# Altium schematic sheet RF-Remute-FT.SchDoc
size C; SheetNumber: 1; SheetTotal: 1
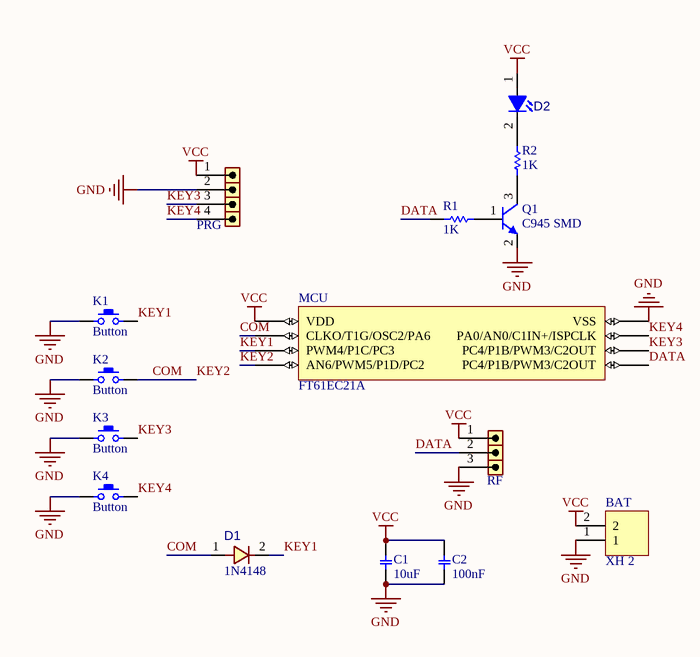
[diagram p0: RF-Remute-FT.SchDoc]

## Parts
BAT  XH 2  [XH 2 PIN ( White )]
C1  value 10uF  [C0805]  (hidden comment: Capacitor SMD 0805)
C2  value 100nF  [C0805]  (hidden comment: Capacitor SMD 0805)
D1  value 1N4148  [D_SOD80]  (hidden comment: 1N4148 SMD)
D2  LED SMD 0805  [LED SMD 0805 (Green)]  (value not drawn)
K1  Button  [BUTTON]
K2  Button  [BUTTON]
K3  Button  [BUTTON]
K4  Button  [BUTTON]
MCU  FT61EC21A  [SOP-8]
PRG  Female Header Single 4  [HDR_F_1X4]  (value not drawn)
Q1  value C945 SMD  [SOT-23]  (hidden comment: C945 NPN SMD)
R1  value 1K  [R0805]  (hidden comment: Resistor SMD 0805)
R2  value 1K  [R0805]  (hidden comment: Resistor SMD 0805)
RF  Female Header Single 3  [HDR_F_1X3]  (value not drawn)

## Nets
GND: BAT.1 C1.1 C2.1 K1.1 K2.1 K3.1 K4.1 MCU.8(VSS) PRG.2 Q1.2(E) RF.3
VCC: BAT.2 C1.2 C2.2 D2.1(ANODE) MCU.1(VDD) PRG.1 RF.1
COM: D1.1 K2.2 MCU.2(CLKO/T1G/OSC2/PA6) MCU.4(AN6/PWM5/P1D/PC2)  [also labelled KEY2]
DATA: MCU.5(PC4/P1B/PWM3/C2OUT) R1.2 RF.2
KEY1: D1.2 K1.2 MCU.3(PWM4/P1C/PC3)
KEY3: K3.2 MCU.6(PC4/P1B/PWM3/C2OUT) PRG.3
KEY4: K4.2 MCU.7(PA0/AN0/C1IN+/ISPCLK) PRG.4
NetD2_2: D2.2(CATHODE) R2.2
NetQ1_1: Q1.1(B) R1.1
NetQ1_3: Q1.3(C) R2.1

## Library data of the parts
BAT = Conector XH 2 Pin: ComponentLink1Description: Tarahiboard; ComponentLink1URL: https://www.tarahiboard.com/product/library-pack; DatasheetVersion: 2022
C1 C2 = Capacitor SMD 0805: Capacitor C SMD 0805; DatasheetVersion: 2022; ComponentLink1Description: Tarahiboard; ComponentLink1URL: https://www.tarahiboard.com
D1 = 1N4148 SMD: DIODE, FAST SWTICHING, 0.3A, 0.5W; DatasheetVersion: 2022; ComponentLink1Description: Tarahiboard; ComponentLink1URL: https://www.tarahiboard.com/product/library-pack
K1-K4 = BUTTON-6.3.4-SMD: Manufacturer: Panasonic; Manufacturer Part Number: EVQ-PE605T; Mechanical Life: 30000Cycles; Actuator Color: Brown; Voltage Rating (DC): 12V; Throw Configuration: SPST; Contact Resistance: 100mR; Operating Force: 2.4N; Current Rating: 50mA; Illumination Type: Non-Illuminated,Illuminated; Switch Travel: 0.25mm; Switch Function: Off-Mom; Actuator Type: Standard; Actuator Length: 1.5mm; Supplier 1: Digi-Key; RoHS: Yes; Category: Tactile Switches; Stock 1: 1845; Pricing 1: 1=0.42000, 10=0.41000, 25=0.38600, 100=0.33510, 250=0.30400, 500=0.28280, 1000=0.25452, 2500=0.23897, 5000=0.22200 (USD); Mount: Through Hole; Contact Plating: Silver; Min Operating Temperature: -30°C; Max Operating Temperature: 85°C; Packaging: Bulk; Package Quantity: 1000; Max Voltage Rating (DC): 12V; Contact Current Rating: 50mA; Termination: PC Pin; Electrical Life: 30000Cycles; Orientation: Straight; Series: EVQPE; Size: 3.5mm; REACH SVHC: No SVHC; Lead Free: Lead Free; RoHS Compliant: Yes; ComponentLink1URL: https://datasheet.ciiva.com/25603/0900766b810ad3e5-25603911.pdf?src-supplier=RSComponents; ComponentLink1Description: https://datasheet.ciiva.com/25603/0900766b810ad3e5-25603911.pdf?src-supplier=RSComponents; ComponentLink2URL: https://datasheet.ciiva.com/30091/atv0000ce8-30091136.pdf?src-supplier=Onlinecomponents.com; ComponentLink2Description: https://datasheet.ciiva.com/30091/atv0000ce8-30091136.pdf?src-supplier=Onlinecomponents.com; ComponentLink3URL: https://datasheet.ciiva.com/16377/atk0000ce35-16377527.pdf?src-supplier=Future+Electronics; ComponentLink3Description: https://datasheet.ciiva.com/16377/atk0000ce35-16377527.pdf?src-supplier=Future+Electronics; ComponentLink4URL: https://datasheet.ciiva.com/16155/atv0000ce8-16155306.pdf?src-supplier=Onlinecomponents.com; ComponentLink4Description: https://datasheet.ciiva.com/16155/atv0000ce8-16155306.pdf?src-supplier=Onlinecomponents.com; Supplier Part Number 1: P13592S-ND; Supplier 2: Digi-Key
PRG = Female Header Single 4: Female, pitch: 2.54mm; ComponentLink1Description: Tarahiboard; ComponentLink1URL: https://www.tarahiboard.com/product/library-pack; DatasheetVersion: 2022
RF = Female Header Single 3: Female, pitch: 2.54mm; ComponentLink1Description: Tarahiboard; ComponentLink1URL: https://www.tarahiboard.com/product/library-pack; DatasheetVersion: 2022
D2 = LED SMD 0805: ComponentLink1Description: Tarahiboard; ComponentLink1URL: https://www.tarahiboard.com/product/library-pack; DatasheetVersion: 2022
Q1 = C945 NPN SMD: ComponentLink1Description: Tarahiboard; ComponentLink1URL: https://www.tarahiboard.com/product/library-pack; DatasheetVersion: 2022
R1 R2 = Resistor SMD 0805: DatasheetVersion: 2022; ComponentLink1Description: Website: Tarahiboard; ComponentLink1URL: https://www.tarahiboard.com/product/library-pack